# Altium schematic sheet Top.SchDoc
size A4; SheetNumber: 1; SheetTotal: 2
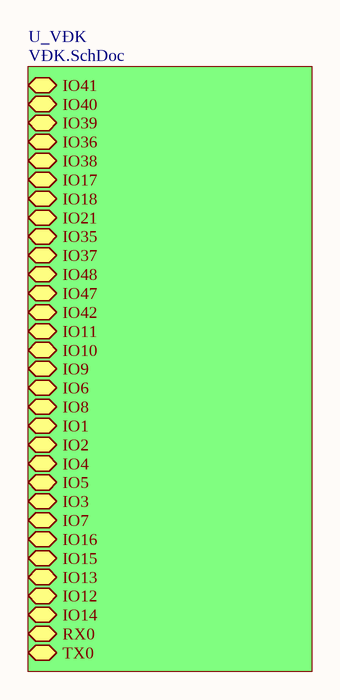
[diagram p0: Top.SchDoc]

## Sub-sheets
U_VĐK = VĐK.SchDoc: IO41 (bidir), IO40 (bidir), IO39 (bidir), IO36 (bidir), IO38 (bidir), IO17 (bidir), IO18 (bidir), IO21 (bidir), IO35 (bidir), IO37 (bidir), IO48 (bidir), IO47 (bidir), IO42 (bidir), IO11 (bidir), IO10 (bidir), IO9 (bidir), IO6 (bidir), IO8 (bidir), IO1 (bidir), IO2 (bidir), IO4 (bidir), IO5 (bidir), IO3 (bidir), IO7 (bidir), IO16 (bidir), IO15 (bidir), IO13 (bidir), IO12 (bidir), IO14 (bidir), RX0 (bidir), TX0 (bidir)